# EAGLE design xr_vco_components (EAGLE 7.3.0)
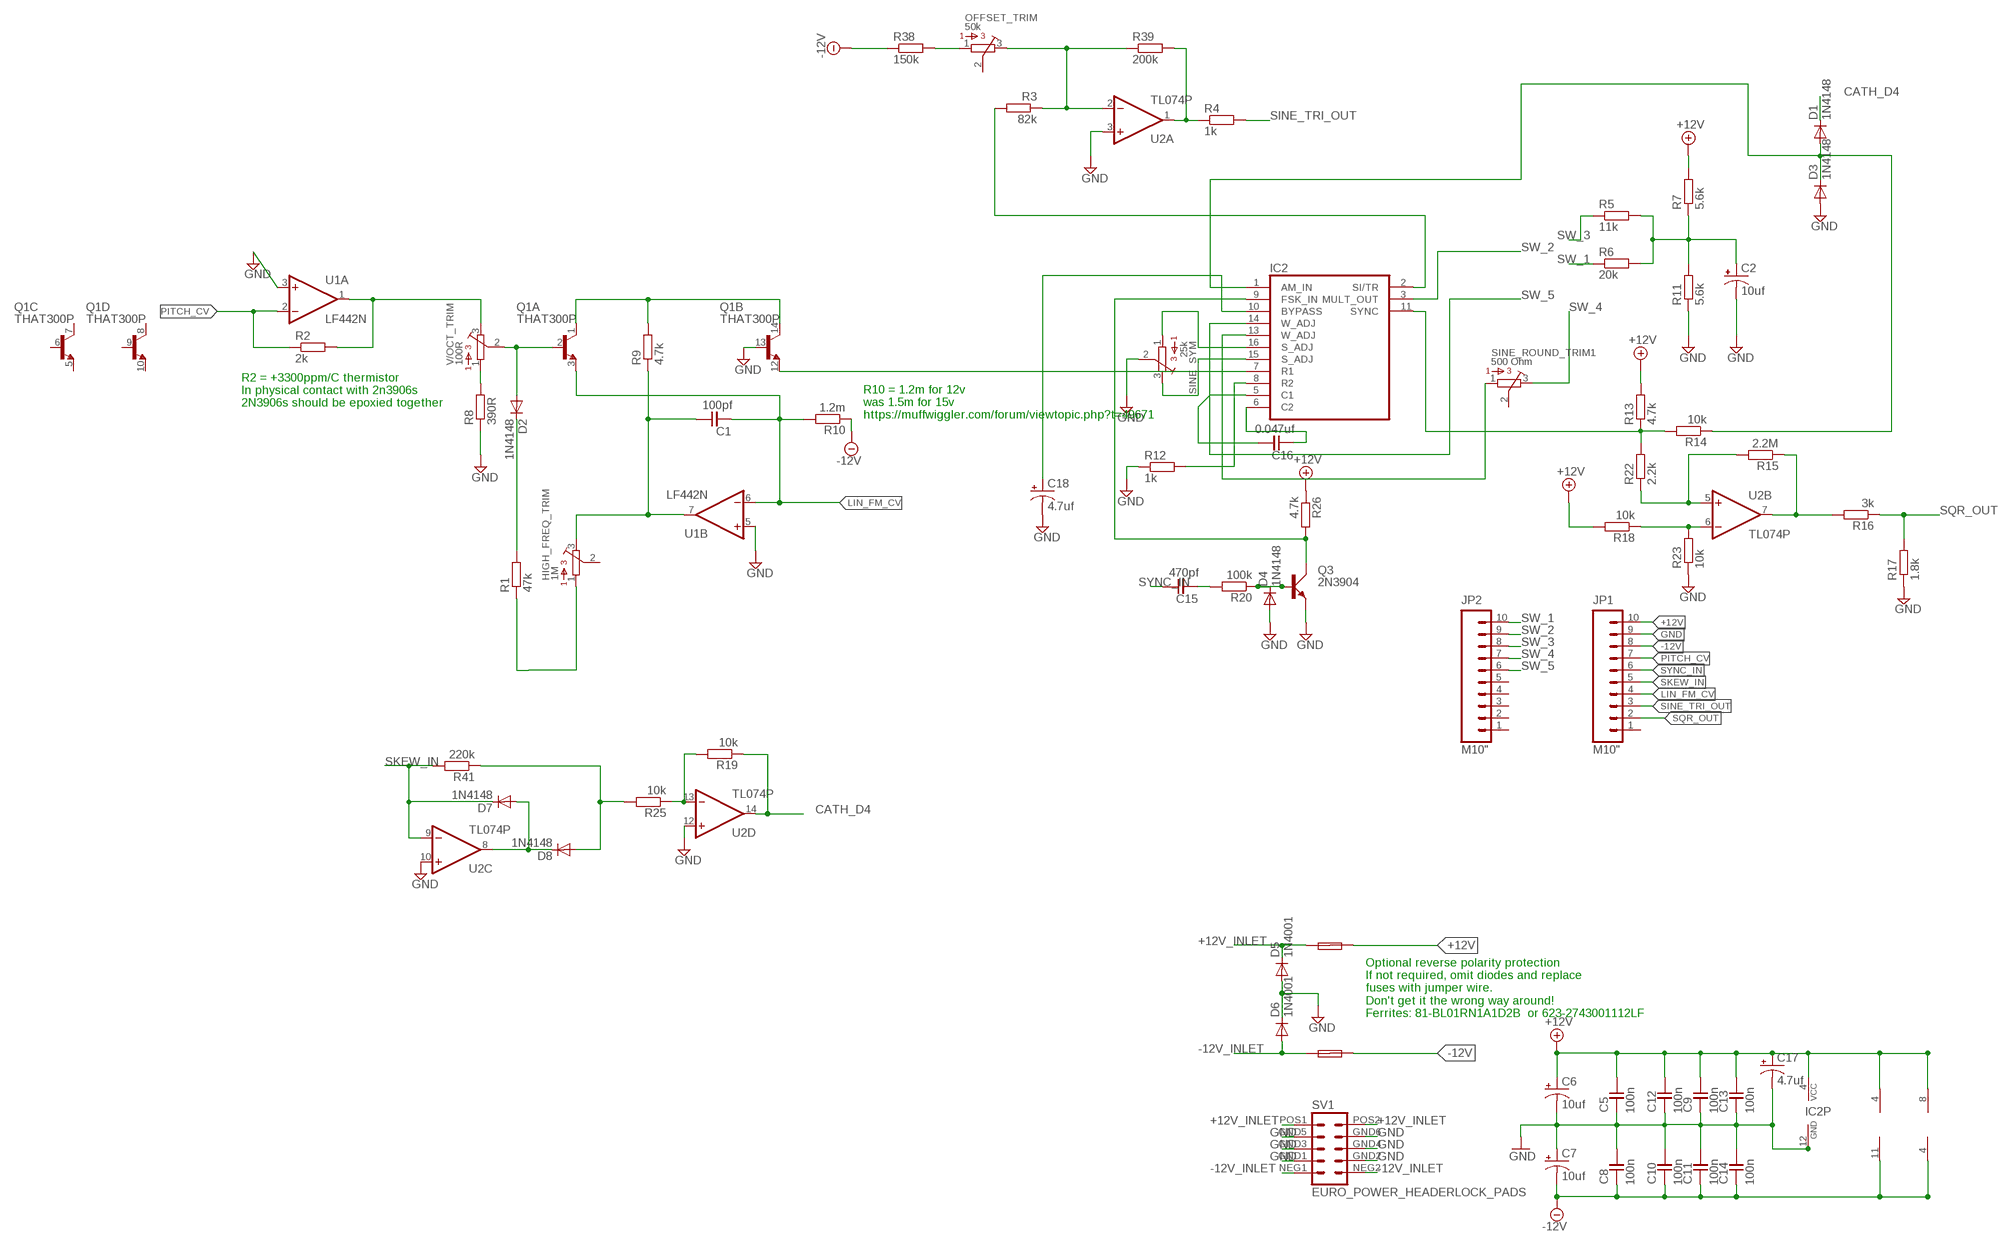
[diagram p0: schematic, sheet 1]

## Parts
C1  100pf  C-EU050-024X044  [C050-024X044]
C2  10uf  CAP_POLPTH2  [CPOL-RADIAL-10UF-25V]
C5  100n  C-EU050-024X044  [C050-024X044]
C6  10uf  CAP_POLPTH2  [CPOL-RADIAL-10UF-25V]
C7  10uf  CAP_POLPTH2  [CPOL-RADIAL-10UF-25V]
C8  100n  C-EU050-024X044  [C050-024X044]
C9  100n  C-EU050-024X044  [C050-024X044]
C10  100n  C-EU050-024X044  [C050-024X044]
C11  100n  C-EU050-024X044  [C050-024X044]
C12  100n  C-EU050-024X044  [C050-024X044]
C13  100n  C-EU050-024X044  [C050-024X044]
C14  100n  C-EU050-024X044  [C050-024X044]
C15  470pf  C-EU050-024X044  [C050-024X044]
C16  0.047uf  C-EU050-024X044  [C050-024X044]
C17  4.7uf  CAP_POLPTH2  [CPOL-RADIAL-10UF-25V]
C18  4.7uf  CAP_POLPTH2  [CPOL-RADIAL-10UF-25V]
D1  1N4148  SMALL_DIODEDO35-7  [DO35-7]
D2  1N4148  SMALL_DIODEDO35-7  [DO35-7]
D3  1N4148  SMALL_DIODEDO35-7  [DO35-7]
D4  1N4148  SMALL_DIODEDO35-7  [DO35-7]
D5  1N4001  1N4004  [DO41-10]
D6  1N4001  1N4004  [DO41-10]
D7  1N4148  SMALL_DIODEDO35-7  [DO35-7]
D8  1N4148  SMALL_DIODEDO35-7  [DO35-7]
F1  FUSE  PTC_FUSEPOLY_FUSE  [C050H075X075]
F2  FUSE  PTC_FUSEPOLY_FUSE  [C050H075X075]
HIGH_FREQ_TRIM  1M  BOURNS_3362P_TRIMMERP  [BOURNS_3362P_TRIMMER]
IC2  XR-2206  [DIL16]
JP1  M10"  [1X10]
JP2  M10"  [1X10]
OFFSET_TRIM  50k  BOURNS_3362P_TRIMMERP  [BOURNS_3362P_TRIMMER]
Q1  THAT300P  [DIL14]
Q3  2N3904  [TO92D]
R1  47k  RESISTOR7MM  [7MM_RESISTOR]
R2  2k  RESISTOR7MM  [7MM_RESISTOR]
R3  82k  RESISTOR7MM  [7MM_RESISTOR]
R4  1k  RESISTOR7MM  [7MM_RESISTOR]
R5  11k  RESISTOR7MM  [7MM_RESISTOR]
R6  20k  RESISTOR7MM  [7MM_RESISTOR]
R7  5.6k  RESISTOR7MM  [7MM_RESISTOR]
R8  390R  RESISTOR7MM  [7MM_RESISTOR]
R9  4.7k  RESISTOR7MM  [7MM_RESISTOR]
R10  1.2m  RESISTOR7MM  [7MM_RESISTOR]
R11  5.6k  RESISTOR7MM  [7MM_RESISTOR]
R12  1k  RESISTOR7MM  [7MM_RESISTOR]
R13  4.7k  RESISTOR7MM  [7MM_RESISTOR]
R14  10k  RESISTOR7MM  [7MM_RESISTOR]
R15  2.2M  RESISTOR7MM  [7MM_RESISTOR]
R16  3k  RESISTOR7MM  [7MM_RESISTOR]
R17  1.8k  RESISTOR7MM  [7MM_RESISTOR]
R18  10k  RESISTOR7MM  [7MM_RESISTOR]
R19  10k  RESISTOR7MM  [7MM_RESISTOR]
R20  100k  RESISTOR7MM  [7MM_RESISTOR]
R22  2.2k  RESISTOR7MM  [7MM_RESISTOR]
R23  10k  RESISTOR7MM  [7MM_RESISTOR]
R25  10k  RESISTOR7MM  [7MM_RESISTOR]
R26  4.7k  RESISTOR7MM  [7MM_RESISTOR]
R38  150k  RESISTOR7MM  [7MM_RESISTOR]
R39  200k  RESISTOR7MM  [7MM_RESISTOR]
R41  220k  RESISTOR7MM  [7MM_RESISTOR]
SINE_ROUND_TRIM1  500 Ohm  BOURNS_3362P_TRIMMERP  [BOURNS_3362P_TRIMMER]
SINE_SYM  25k  BOURNS_3362P_TRIMMERP  [BOURNS_3362P_TRIMMER]
SV1  EURO_POWER_HEADERLOCK_PADS  [EURO_PWR_HEADER_LOCK]
U1  LF442N  [DIL08]
U2  TL074P  [DIL14]
V/OCT_TRIM  100R  BOURNS_3362P_TRIMMERP  [BOURNS_3362P_TRIMMER]

## Nets
+12V: C5.1 C6.1(+) C9.1 C12.1 C13.1 C17.1(+) F1.2 IC2.4(VCC) JP1.10 R7.2 R13.2 R18.2 R26.1 U1.8(P:V+) U2.4(P:V+)
+12V_INLET [power]: D5.C F1.1 SV1.POS1 SV1.POS2
-12V: C7.2(-) C8.2 C10.2 C11.2 C14.2 F2.2 JP1.8 R10.1 R38.1 U1.4(P:V-) U2.11(P:V-)
-12V_INLET [power]: D6.A F2.1 SV1.NEG1 SV1.NEG2
CATH_D4: D1.C R19.1 U2.14(D:OUT)
GND: C2.2(-) C5.2 C6.2(-) C7.1(+) C8.1 C9.2 C10.1 C11.1 C12.2 C13.2 C14.1 C17.2(-) C18.2(-) D3.A D4.A D5.A D6.C IC2.12(GND) JP1.9 Q1.13(B:B) Q3.E R8.1 R11.1 R12.1 R17.1 R23.1 SINE_SYM.2 SV1.GND1 SV1.GND2 SV1.GND3 SV1.GND4 SV1.GND5 SV1.GND6 U1.3(A:+IN) U1.5(B:+IN) U2.3(A:+IN) U2.10(C:+IN) U2.12(D:+IN)
LIN_FM_CV: C1.2 JP1.4 Q1.3(A:E) R10.2 U1.6(B:-IN)
N$1: IC2.7(R1) Q1.12(B:E)
N$2: D2.C R1.2
N$3: HIGH_FREQ_TRIM.1 R1.1
N$5: IC2.2(SI/TR) R3.2
N$7: R2.2 U1.1(A:OUT) V/OCT_TRIM.3
N$8: OFFSET_TRIM.3 R3.1 R39.1 U2.2(A:-IN)
N$9: R8.2 V/OCT_TRIM.1
N$10: D2.A Q1.2(A:B) V/OCT_TRIM.2
N$11: Q1.1(A:C) Q1.14(B:C) R9.2
N$12: OFFSET_TRIM.1 R38.2
N$13: R4.1 R39.2 U2.1(A:OUT)
N$15: C1.1 HIGH_FREQ_TRIM.3 R9.1 U1.7(B:OUT)
N$16: C2.1(+) R5.2 R6.2 R7.1 R11.2
N$17: IC2.16(S_ADJ) SINE_SYM.1
N$20: IC2.13(W_ADJ) SINE_ROUND_TRIM1.1
N$21: IC2.15(S_ADJ) SINE_SYM.3
N$22: IC2.8(R2) R12.2
N$23: R18.1 R23.2 U2.6(B:-IN)
N$24: R15.1 R16.2 U2.7(B:OUT)
N$25: R19.2 R25.1 U2.13(D:-IN)
N$26: R15.2 R22.1 U2.5(B:+IN)
N$27: D1.A D3.C IC2.1(AM_IN) R14.1
N$28: C15.2 R20.2
N$29: D4.C Q3.B R20.1
N$30: IC2.11(SYNC) R13.1 R14.2 R22.2
N$31: IC2.9(FSK_IN) Q3.C R26.2
N$32: C16.2 IC2.6(C2)
N$33: C16.1 IC2.5(C1)
N$34: C18.1(+) IC2.10(BYPASS)
N$35: D7.A D8.C U2.8(C:OUT)
N$36: D8.A R25.2 R41.1
PITCH_CV: JP1.7 R2.1 U1.2(A:-IN)
SINE_TRI_OUT: JP1.3 R4.2
SKEW_IN: D7.C JP1.5 R41.2 U2.9(C:-IN)
SQR_OUT: JP1.2 R16.1 R17.2
SW_1: JP2.10 R6.1
SW_2: IC2.3(MULT_OUT) JP2.9
SW_3: JP2.8 R5.1
SW_4: JP2.7 SINE_ROUND_TRIM1.3
SW_5: IC2.14(W_ADJ) JP2.6
SYNC_IN: C15.1 JP1.6
Unconnected: HIGH_FREQ_TRIM.2 JP1.1 JP2.1 JP2.2 JP2.3 JP2.4 JP2.5 OFFSET_TRIM.2 Q1.5(C:E) Q1.6(C:B) Q1.7(C:C) Q1.8(D:C) Q1.9(D:B) Q1.10(D:E) SINE_ROUND_TRIM1.2

## Notes on the sheet
- R2 = +3300ppm/C thermistor
  In physical contact with 2n3906s
  2N3906s should be epoxied together
- R10 = 1.2m for 12v
  was 1.5m for 15v
  https://muffwiggler.com/forum/viewtopic.php?t=49671
- Optional reverse polarity protection
  If not required, omit diodes and replace
  fuses with jumper wire. 
  Don't get it the wrong way around! 
  Ferrites: 81-BL01RN1A1D2B  or 623-2743001112LF

## Library data of the parts
C1 C5 C8-C16 = TomW:C-EU: CAPACITOR, European symbol
C2 C6 C7 C17 C18 = SparkFun-Passives:CAP_POL: Capacitor Polarized These are standard SMD and PTH capacitors. Normally 10uF, 47uF, and 100uF in electrolytic and tantalum varieties. Always verify the external diameter of the through hole cap, it varies with capacity, voltage, and manufacturer. The EIA devices should be standard.
D1-D4 D7 D8 = MusicThingModular:SMALL_DIODE: Small Signal Diode
D5 D6 = diode:1N4004: DIODE general purpose rectifier, 1 A
F1 F2 = TomW:PTC_FUSE
HIGH_FREQ_TRIM OFFSET_TRIM SINE_ROUND_TRIM1 SINE_SYM V/OCT_TRIM = MusicThingModular:BOURNS_3362P_TRIMMER: 3362 Series 1/4" Square Trimmer
IC2 = exar:XR-2206: Monolithic FUNCTION GENERATOR; OC_FARNELL: unknown; OC_NEWARK: unknown
JP1 JP2 = SparkFun-Connectors:M10: Header 10 Standard 10-pin 0.1" header. Use with straight break away headers (SKU : PRT-00116), right angle break away headers (PRT-00553), swiss pins (PRT-00743), machine pins (PRT-00117), and female headers (PRT-00115).
Q1 = that-corp:THAT300: 4-Matched NPN Transistors
Q3 = transistor-small-signal:2N3904: NPN TRANSISTOR
R1-R20 R22 R23 R25 R26 R38 R39 R41 = MusicThingModular:RESISTOR: Standard resistor, various versions
SV1 = MusicThingModular:EURO_POWER_HEADER: Power Header 10 pin power header for Eurorack Power Supplies Variants with fatter pads for easier soldering, and the LOCK variant which has 5mil offset pins to hold the component in place before soldering
U1 = linear:LF442: OP AMP
U2 = linear:TL074: OP AMP

## Net classes
1 power: width 0.406 mm
2 ground: width 0.305 mm

## Board
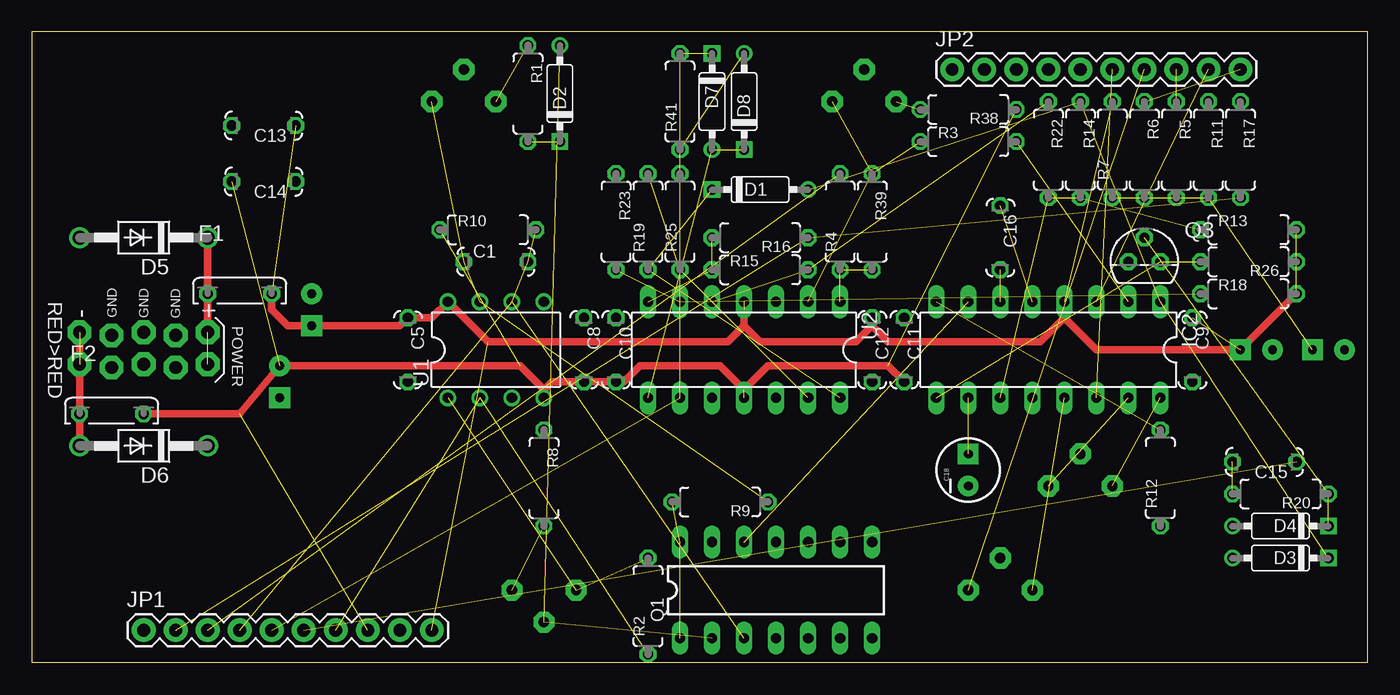
[diagram p1: board, top side]
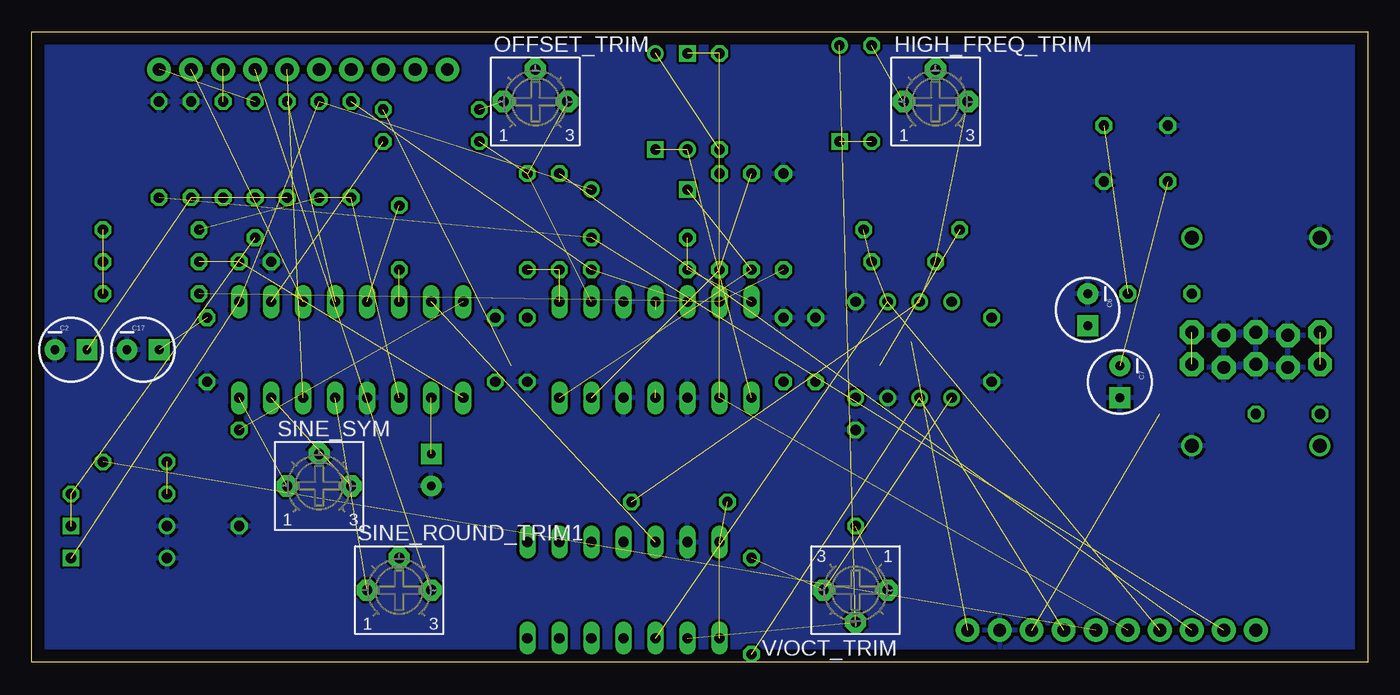
[diagram p2: board, bottom side, seen from below]

Size 106 x 50 mm. Coordinates in mm from the lower left corner, seen from the top.
Outline: 0,0 106,0 106,50 0,50 0,0
Copper layers (1*16): Top 0.035mm / dielectric 1.5mm / Bottom 0.035mm
Design rules "default": minimum track width 10mil, minimum drill 24mil, track to track 8mil, track to pad 8mil, pad to pad 8mil, via to via 8mil, smd to smd 8mil, copper to edge 40mil, drill to drill 8mil, minimum pad ring 10mil, minimum via ring 8mil, stop-mask expansion 4mil, vias tented up to drill 0mil, thermal gap 10mil

### Footprints (pad centres in the part's own frame; a part is rotated, then mirrored left to right if it is on the bottom)
C050-024X044 = drill 0.813 octagon: 1 -2.54,0; 2 2.54,0
CPOL-RADIAL-10UF-25V = drill 0.7 pad 1.651 square: 1 1.27,0 | drill 0.7 pad 1.651: 2 -1.27,0
DO35-7 = drill 0.813: A 3.81,0 | drill 0.813 square: C -3.81,0
DO41-10 = drill 1.118: A 5.08,0; C -5.08,0
C050H075X075 = drill 0.813 octagon: 1 -2.54,0; 2 2.54,0
BOURNS_3362P_TRIMMER = drill 0.813 pad 1.676 octagon: 1 -2.54,0; 2 0,2.54; 3 2.54,0
DIL16 = drill 0.813 long: 1 -8.89,-3.81; 2 -6.35,-3.81; 3 -3.81,-3.81; 4 -1.27,-3.81; 5 1.27,-3.81; 6 3.81,-3.81; 7 6.35,-3.81; 8 8.89,-3.81; 9 8.89,3.81; 10 6.35,3.81; 11 3.81,3.81; 12 1.27,3.81; 13 -1.27,3.81; 14 -3.81,3.81; 15 -6.35,3.81; 16 -8.89,3.81
1X10 = drill 1.016 pad 1.88: 1 0,0; 2 2.54,0; 3 5.08,0; 4 7.62,0; 5 10.16,0; 6 12.7,0; 7 15.24,0; 8 17.78,0; 9 20.32,0; 10 22.86,0
DIL14 = drill 0.813 long: 1 -7.62,-3.81; 2 -5.08,-3.81; 3 -2.54,-3.81; 4 0,-3.81; 5 2.54,-3.81; 6 5.08,-3.81; 7 7.62,-3.81; 8 7.62,3.81; 9 5.08,3.81; 10 2.54,3.81; 11 0,3.81; 12 -2.54,3.81; 13 -5.08,3.81; 14 -7.62,3.81
TO92D = drill 0.813 octagon: B 0,1.905; C 1.27,0; E -1.27,0
7MM_RESISTOR = drill 0.813 octagon: 1 -3.81,0; 2 3.81,0
EURO_PWR_HEADER_LOCK = drill 1.016 pad 1.88 octagon: GND1 -2.54,1.143; GND2 -2.54,-1.397; GND3 0,1.397; GND4 0,-1.143; GND5 2.54,1.143; GND6 2.54,-1.397; NEG1 -5.08,1.397; NEG2 -5.08,-1.143; POS1 5.08,1.397; POS2 5.08,-1.143
DIL08 = drill 0.813 pad 1.27: 1 -3.81,-3.81; 2 -1.27,-3.81; 3 1.27,-3.81; 4 3.81,-3.81; 5 3.81,3.81; 6 1.27,3.81; 7 -1.27,3.81; 8 -3.81,3.81

### Placement (x,y rotation side)
C1  36.83,31.75 0 top
C2  102.87,24.77 0 bottom
C5  29.84,24.77 270 top
C6  22.23,27.94 270 bottom
C7  19.68,22.23 270 bottom
C8  43.81,24.77 270 top
C9  92.08,24.77 270 top
C10  46.35,24.77 270 top
C11  69.22,24.77 270 top
C12  66.67,24.77 270 top
C13  18.41,42.55 180 top
C14  18.41,38.1 180 top
C15  97.79,15.88 180 top
C16  76.83,33.66 270 top
C17  97.16,24.77 0 bottom
C18  74.3,15.24 90 top
D1  57.78,37.47 0 top
D2  41.91,45.09 90 top
D3  99.06,8.26 180 top
D4  99.06,10.79 180 top
D5  8.89,33.66 180 top
D6  8.89,17.14 180 top
D7  53.98,44.45 270 top
D8  56.52,44.45 90 top
F1  16.51,29.21 0 top
F2  6.35,19.68 0 top
HIGH_FREQ_TRIM  34.29,44.45 0 bottom
IC2  80.64,24.77 180 top
JP1  8.89,2.54 0 top
JP2  73.03,46.99 0 top
OFFSET_TRIM  66.04,44.45 0 bottom
Q1  59.05,5.71 0 top
Q3  88.27,31.75 0 top
R1  39.37,45.09 270 top
R2  48.9,4.45 90 top
R3  74.3,41.27 0 top
R4  64.14,34.92 90 top
R5  90.81,40.64 270 top
R6  88.27,40.64 270 top
R7  85.72,40.64 90 top
R8  40.64,14.61 270 top
R9  54.61,12.7 180 top
R10  36.2,34.29 0 top
R11  93.34,40.64 270 top
R12  89.53,14.61 90 top
R13  96.52,34.29 0 top
R14  83.19,40.64 270 top
R15  57.78,31.11 0 top
R16  57.78,33.66 180 top
R17  95.89,40.64 270 top
R18  96.52,29.21 0 top
R19  48.9,34.92 90 top
R20  99.06,13.34 180 top
R22  80.64,40.64 270 top
R23  46.35,34.92 270 top
R25  51.44,34.92 90 top
R26  96.52,31.75 180 top
R38  74.3,43.81 180 top
R39  66.67,34.92 270 top
R41  51.44,44.45 90 top
SINE_ROUND_TRIM1  76.83,5.71 0 bottom
SINE_SYM  83.19,13.97 0 bottom
SV1  8.89,24.77 0 top
U1  36.83,24.77 0 top
U2  56.52,24.77 180 top
V/OCT_TRIM  40.64,5.71 180 bottom

### Tracks (layer width: path | path; a pad name or v marks a point on that pad's centre or on a via)
+12V  (7 unrouted)
  Top 0.61: F1.2 19.05,27.94 20.32,26.67 C6.1 29.21,26.67 C5.1 31.75,27.3 U1.8 36.2,25.4 55.24,25.4 56.52,26.67 | 56.52,27.94 56.52,26.67 | 56.52,26.67 57.78,25.4 65.41,25.4 66.67,26.67 | 66.67,26.67 C12.1 | 66.67,26.67 67.94,25.4 80.01,25.4 81.92,27.3 | IC2.4 81.92,27.3 | 81.92,27.3 84.45,24.77 C17.1 R18.2
+12V_INLET  (1 unrouted)
  Top 0.61: SV1.POS1 F1.1 D5.C
-12V  (5 unrouted)
  Top 0.61: F2.2 16.51,19.68 C7.2 38.73,23.5 40.64,21.59 | U1.4 40.64,21.59 | 40.64,21.59 41.27,22.23 C8.2 C10.2 46.99,22.23 48.26,23.5 54.61,23.5 56.52,21.59 58.42,23.5 67.94,23.5 C11.2
-12V_INLET  (1 unrouted)
  Top 0.61: SV1.NEG1 F2.1 D6.A
CATH_D4  (2 unrouted)
GND
  pour Bottom: -0.64,50.8 -0.64,-0.64 106.68,-0.64 106.68,0 106.68,50.8
LIN_FM_CV  (4 unrouted)
N$1  (1 unrouted)
N$2  (1 unrouted)
N$3  (1 unrouted)
N$5  (1 unrouted)
N$7  (2 unrouted)
N$8  (3 unrouted)
N$9  (1 unrouted)
N$10  (2 unrouted)
N$11  (2 unrouted)
N$12  (1 unrouted)
N$13  (2 unrouted)
N$15  (3 unrouted)
N$16  (4 unrouted)
N$17  (1 unrouted)
N$20  (1 unrouted)
N$21  (1 unrouted)
N$22  (1 unrouted)
N$23  (2 unrouted)
N$24  (2 unrouted)
N$25  (2 unrouted)
N$26  (2 unrouted)
N$27  (3 unrouted)
N$28  (1 unrouted)
N$29  (2 unrouted)
N$30  (3 unrouted)
N$31  (2 unrouted)
N$32  (1 unrouted)
N$33  (1 unrouted)
N$34  (1 unrouted)
N$35  (2 unrouted)
N$36  (2 unrouted)
PITCH_CV  (2 unrouted)
SINE_TRI_OUT  (1 unrouted)
SKEW_IN  (3 unrouted)
SQR_OUT  (2 unrouted)
SW_1  (1 unrouted)
SW_2  (1 unrouted)
SW_3  (1 unrouted)
SW_4  (1 unrouted)
SW_5  (1 unrouted)
SYNC_IN  (1 unrouted)